# Altium project OGS_Tiny_RFPowering.PrjPCB
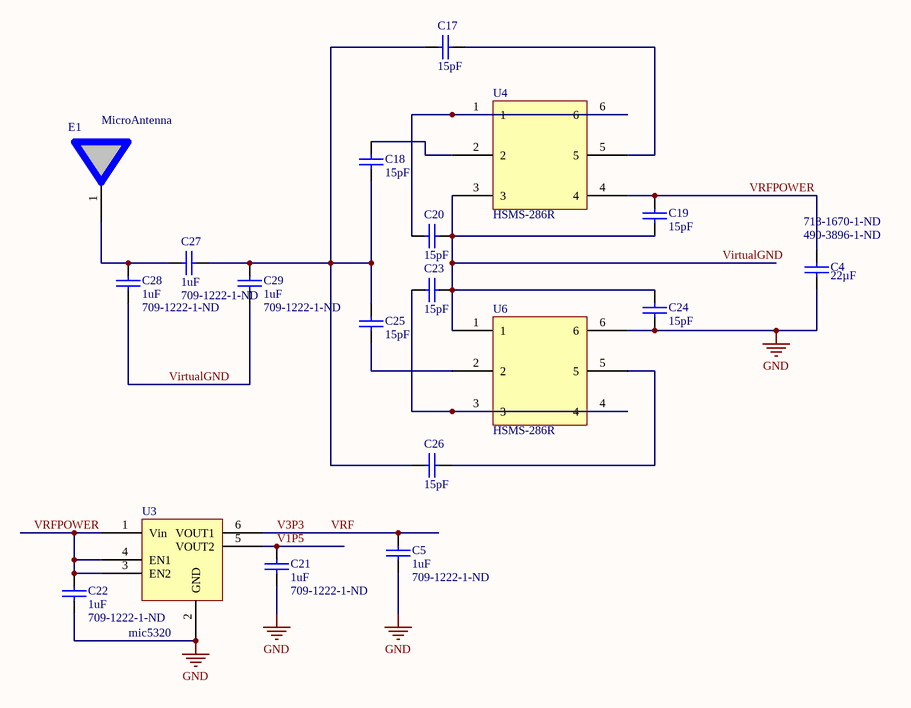
[diagram p0: RF_POWER.SchDoc]
2 sheets, 28 parts. Net scope: global (net labels, ports and power ports of the same name join across sheets).
Board file: OGS_ASIC_RFPOWERING.PcbDoc
Sheets:
  RF_POWER.SchDoc
  SingleASIC.SchDoc

## Sheet RF_POWER.SchDoc
size A

### Parts
C4  Supplier Part Number 1: 490-3896-1-ND  Capacitance: 22µF  Supplier Part Number 2: 718-1670-1-ND  [1608[0603]]  (hidden comment: NP0 50V)
C5  value 1uF  Supplier Part Number 1: 709-1222-1-ND  [0402l]  (hidden comment: NP0 50V)
C17  value 15pF  [0201]  (hidden comment: NP0 50V)
C18  value 15pF  [0201]  (hidden comment: NP0 50V)
C19  value 15pF  [0201]  (hidden comment: NP0 50V)
C20  value 15pF  [0201]  (hidden comment: NP0 50V)
C21  value 1uF  Supplier Part Number 1: 709-1222-1-ND  [0402l]  (hidden comment: NP0 50V)
C22  value 1uF  Supplier Part Number 1: 709-1222-1-ND  [0402l]  (hidden comment: NP0 50V)
C23  value 15pF  [0201]  (hidden comment: NP0 50V)
C24  value 15pF  [0201]  (hidden comment: NP0 50V)
C25  value 15pF  [0201]  (hidden comment: NP0 50V)
C26  value 15pF  [0201]  (hidden comment: NP0 50V)
C27  value 1uF  Supplier Part Number 1: 709-1222-1-ND  [0402l]  (hidden comment: NP0 50V)
C28  value 1uF  Supplier Part Number 1: 709-1222-1-ND  [0402l]  (hidden comment: NP0 50V)
C29  value 1uF  Supplier Part Number 1: 709-1222-1-ND  [0402l]  (hidden comment: NP0 50V)
E1  MicroAntenna  [2450AT18B100]
U3  mic5320  [MLF-6]
U4  HSMS-286R  [SOT363-6M]
U6  HSMS-286R  [SOT363-6M]

### Nets
GND: C4.2 C5.2 C21.2 C22.2 C24.1 U3.2(GND) U6.6
V1P5: C21.1 U3.5(VOUT2)
V3P3: C5.1 U3.6(VOUT1)  [also labelled VRF]
VirtualGND: C19.2 C20.1 C23.1 C24.2 C28.2 C29.2 U4.3 U6.1
VRFPOWER: C4.1 C19.1 C22.1 U3.1(Vin) U3.3(EN2) U3.4(EN1) U4.4
NetC17_1: C17.1 U4.5
NetC17_2: C17.2 C18.1 C25.2 C26.2 C27.1 C29.1
NetC18_2: C18.2 U4.2
NetC20_2: C20.2 U4.1 U4.6
NetC23_2: C23.2 U6.3 U6.4
NetC25_1: C25.1 U6.2
NetC26_1: C26.1 U6.5
NetC27_2: C27.2 C28.1 E1.1

Not connected (* = marked no-connect by the designer): E1 2

### Library data of the parts
C4 = Cap: Capacitor; Part Field 1: 0402; Manufacturer: Murata Electronics North America; Manufacturer Part Number: GRM188R60J106ME47D; Manufacturer Size Code: M; Value: 10uF; Description: CAP CER 10UF 6.3V X5R 0603; Voltage - Rated: 6.3V; Tolerance: ±20%; Temperature Coefficient: X5R; ESR (Equivalent Series Resistance): 1.500 Ohm; Type: Molded; Supplier 1: Digi-Key; RoHS: RoHS Compliant; Category: Capacitors; Stock 1: 1364710; Pricing 1: 1=0.51, 10=0.398, 50=0.2624, 100=0.208, 250=0.15376, 500=0.1194, 1000=0.09407 (USD); Mounting Type: Surface Mount, MLCC; Operating Temperature: -55°C ~ 85°C; Applications: General Purpose; Ratings: -; Package / Case: 0603 (1608 Metric); Size / Dimension: 0.063" L x 0.031" W (1.60mm x 0.80mm); Height: -; Thickness: 0.035" (0.90mm); Lead Spacing: -; Features: -; Packaging: Cut Tape (CT); Lead Style: -; ComponentLink1URL: http://search.murata.co.jp/Ceramy/image/img/PDF/ENG/GRM188R60J106ME47.pdf; ComponentLink1Description: http://search.murata.co.jp/Ceramy/image/img/PDF/ENG/GRM188R60J106ME47.pdf; Supplier 2: Digi-Key; Stock 2: 12402; Pricing 2: 1=2.15, 10=1.785, 100=1.575, 250=1.47, 500=1.3125, 1000=1.05 (USD); Height - Seated (Max): 0.035" (0.89mm); Lifetime @ Temp.: -; ComponentLink2URL: http://www.vishay.com/docs/40114/tr8.pdf; ComponentLink2Description: http://www.vishay.com/docs/40114/tr8.pdf
C5 C21 C22 C27-C29 = Cap: Capacitor; Part Field 1: 0402; Manufacturer: Johanson Dielectrics Inc; Manufacturer Part Number: 100R07X105KV4T; Description: CAP CER 1UF 10V X5R 0402; Capacitance: 1.0µF; Voltage - Rated: 10V; Tolerance: ±10%; Temperature Coefficient: X5R; Supplier 1: Digi-Key; RoHS: RoHS Compliant; Category: Capacitors; Stock 1: 22620; Pricing 1: 10=0.146, 100=0.0861, 500=0.04968, 1000=0.03445 (USD); Mounting Type: Surface Mount, MLCC; Operating Temperature: -55°C ~ 85°C; Applications: SMPS Filtering; Ratings: -; Package / Case: 0402 (1005 Metric); Size / Dimension: 0.040" L x 0.020" W (1.02mm x 0.51mm); Height: -; Thickness: 0.025" (0.64mm); Lead Spacing: -; Features: -; Packaging: Cut Tape (CT); Lead Style: -; ComponentLink1URL: http://www.johansondielectrics.com/images/stories/surface-mount/tanceram/JDI_Tanceram_2010-03.pdf; ComponentLink1Description: http://www.johansondielectrics.com/images/stories/surface-mount/tanceram/JDI_Tanceram_2010-03.pdf
C17-C20 C23-C26 = Cap: Capacitor; Part Field 1: 0201

## Sheet SingleASIC.SchDoc
size A
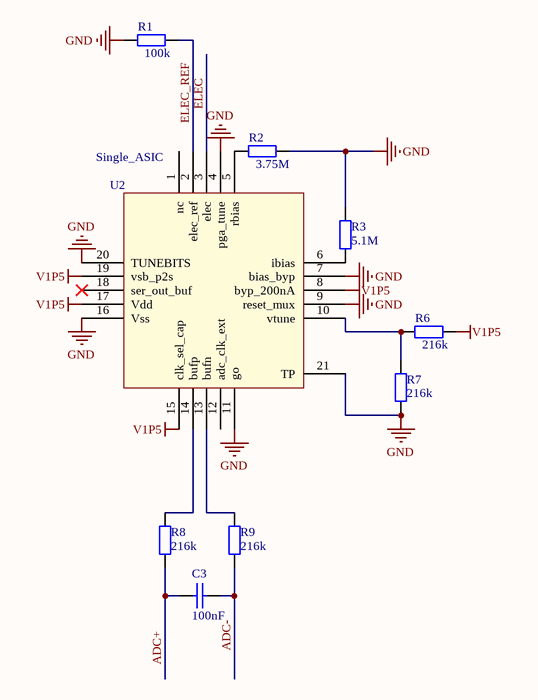
[diagram p1: SingleASIC.SchDoc]

### Parts
C3  value 100nF  [0402L]  (hidden comment: NP0 50V)
R1  value 100k  [0402L]  (hidden comment: Res2)
R2  value 3.75M  [0402L]  (hidden comment: Res2)
R3  value 5.1M  [0402L]  (hidden comment: Res2)
R6  value 216k  [0402L]  (hidden comment: Res2)
R7  value 216k  [0402L]  (hidden comment: Res2)
R8  value 216k  [0402L]  (hidden comment: Res2)
R9  value 216k  [0402L]  (hidden comment: Res2)
U2  Single_ASIC  [Single_ASIC]

### Nets
GND: R1.1 R2.2 R3.2 R7.1 U2.4(pga_tune) U2.7(bias_byp) U2.9(reset_mux) U2.11(go) U2.16(Vss) U2.20(TUNEBITS) U2.21(TP)
V1P5: R6.2 U2.8(byp_200nA) U2.15(clk_sel_cap) U2.17(Vdd) U2.19(vsb_p2s)
ADC+: C3.1 R8.1
ADC-: C3.2 R9.1
ELEC: U2.3(elec)
ELEC_REF: R1.2 U2.2(elec_ref)
NetR2_1: R2.1 U2.5(rbias)
NetR3_1: R3.1 U2.6(ibias)
NetR6_1: R6.1 R7.2 U2.10(vtune)
NetR8_2: R8.2 U2.14(bufp)
NetR9_2: R9.2 U2.13(bufn)

Not connected (* = marked no-connect by the designer): U2 1(nc) 12(adc_clk_ext) 18(ser_out_buf)*

### Library data of the parts
C3 = Cap: Capacitor; Part Field 1: 0402
R1-R3 R6-R9 = Res2: Resistor; Published: 8-Jun-2000; LatestRevisionDate: 17-Jul-2002; LatestRevisionNote: Re-released for DXP Platform.; PackageReference: AXIAL-0.4; Publisher: Altium Limited; PackageDescription: Axial Device, Thru-Hole; 2 Leads; 0.4 in Pin Spacing

## Nets that join several sheets
GND: RF_POWER (7 pins), SingleASIC (11 pins)
V1P5: RF_POWER (C21.1 U3.5), SingleASIC (5 pins)